# Altium project braking_io.PrjPcb (part 1 of 5)
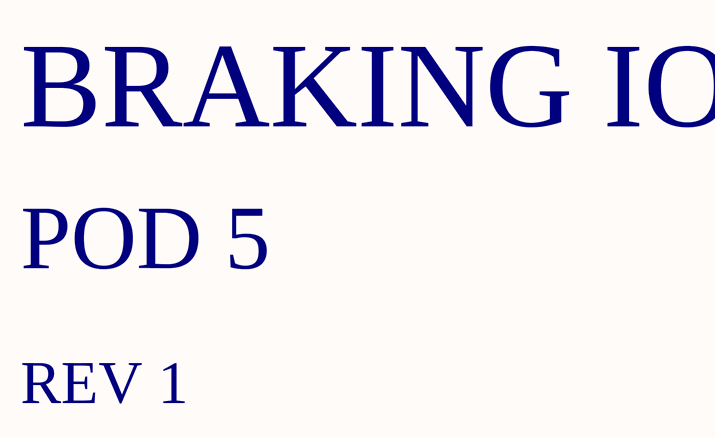
[diagram p0: braking_io.SchDoc]
13 sheets, 451 parts. Net scope: global (net labels, ports and power ports of the same name join across sheets).
Board file: braking_io.PcbDoc
Sheets:
  braking_io.SchDoc
  connectors.SchDoc
  bus_filter.SchDoc
  power_7V.SchDoc
  power_5V.SchDoc
  power_24V.SchDoc
  solenoid.SchDoc
  solenoid_drv.SchDoc
  pressure.SchDoc
  telemetry_adc.SchDoc
  watchdog.SchDoc
  retro.SchDoc
  mcu.SchDoc

## Sheet braking_io.SchDoc: Braking IO PCB
size A4; Organization: Badgerloop Electrical; Address1: 133 Engineering Research Building; Address2: 1500 Engineering Drive; Address3: Madison, Wi 53706

### Notes on the sheet
- BRAKING IO
- POD 5
- REV 1
- Title
- Engineer:
- Date:
- Time:
- Revision:
- Sheet
- of
- File:

## Sheet connectors.SchDoc: Connectors
size A4; Organization: Badgerloop Electrical; Address1: 133 Engineering Research Building; Address2: 1500 Engineering Drive; Address3: Madison, Wi 53706
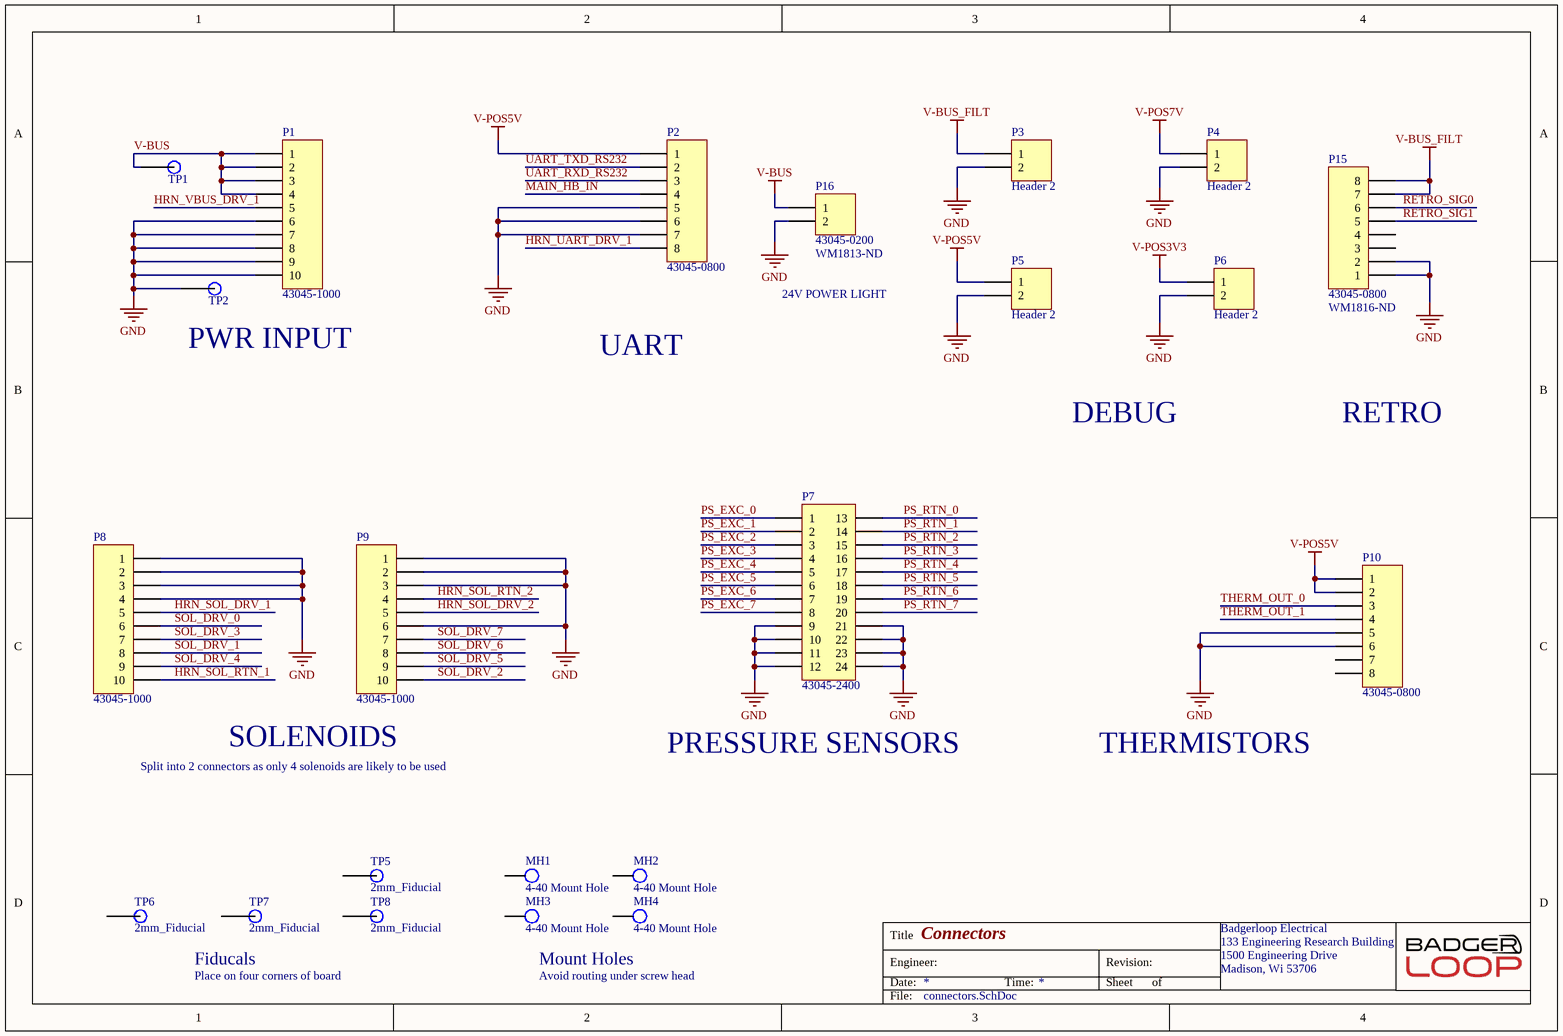
[diagram p1: connectors.SchDoc]

### Parts
MH1  4-40 Mount Hole  [MH]
MH2  4-40 Mount Hole  [MH]
MH3  4-40 Mount Hole  [MH]
MH4  4-40 Mount Hole  [MH]
P1  43045-1000  [430451000]
P2  43045-0800  [430450800]
P3  Header 2  [Pin Header 1x2 TH Pitch 2.54mm]
P4  Header 2  [Pin Header 1x2 TH Pitch 2.54mm]
P5  Header 2  [Pin Header 1x2 TH Pitch 2.54mm]
P6  Header 2  [Pin Header 1x2 TH Pitch 2.54mm]
P7  43045-2400  [430452400]
P8  43045-1000  [430451000]
P9  43045-1000  [430451000]
P10  43045-0800  [430450800]
P15  43045-0800  Supplier Part Number 1: WM1816-ND  [430450800]
P16  43045-0200  Supplier Part Number 1: WM1813-ND  [430450200]
TP1  TP  [Test Point]  (value not drawn)
TP2  TP  [Test Point]  (value not drawn)
TP5  2mm_Fiducial  [2mm_Fiducial]
TP6  2mm_Fiducial  [2mm_Fiducial]
TP7  2mm_Fiducial  [2mm_Fiducial]
TP8  2mm_Fiducial  [2mm_Fiducial]

### Nets
GND: P1.6 P1.7 P1.8 P1.9 P1.10 P2.5 P2.6 P2.7 P3.2 P4.2 P5.2 P6.2 P7.9 P7.10 P7.11 P7.12 P7.21 P7.22 P7.23 P7.24 P8.1 P8.2 P8.3 P8.4 P9.1 P9.2 P9.3 P9.6 P10.5 P10.6 P15.1 P15.2 P16.2 TP2.1
V-BUS: P1.1 P1.2 P1.3 P1.4 P16.1 TP1.1
V-BUS_FILT: P3.1 P15.7 P15.8
V-POS3V3: P6.1
V-POS5V: P2.1 P5.1 P10.1 P10.2
V-POS7V: P4.1
HRN_SOL_DRV_1: P8.5
HRN_SOL_DRV_2: P9.5
HRN_SOL_RTN_1: P8.10
HRN_SOL_RTN_2: P9.4
HRN_UART_DRV_1: P2.8
HRN_VBUS_DRV_1: P1.5
MAIN_HB_IN: P2.4
PS_EXC_0: P7.1
PS_EXC_1: P7.2
PS_EXC_2: P7.3
PS_EXC_3: P7.4
PS_EXC_4: P7.5
PS_EXC_5: P7.6
PS_EXC_6: P7.7
PS_EXC_7: P7.8
PS_RTN_0: P7.13
PS_RTN_1: P7.14
PS_RTN_2: P7.15
PS_RTN_3: P7.16
PS_RTN_4: P7.17
PS_RTN_5: P7.18
PS_RTN_6: P7.19
PS_RTN_7: P7.20
RETRO_SIG0: P15.6
RETRO_SIG1: P15.5
SOL_DRV_0: P8.6
SOL_DRV_1: P8.8
SOL_DRV_2: P9.10
SOL_DRV_3: P8.7
SOL_DRV_4: P8.9
SOL_DRV_5: P9.9
SOL_DRV_6: P9.8
SOL_DRV_7: P9.7
THERM_OUT_0: P10.3
THERM_OUT_1: P10.4
UART_RXD_RS232: P2.3
UART_TXD_RS232: P2.2

Not connected (* = marked no-connect by the designer): MH1 46; MH2 46; MH3 46; MH4 46; P10 7 8; P15 3 4; TP5 1; TP6 1; TP7 1; TP8 1

### Notes on the sheet
- 24V POWER LIGHT
- PWR INPUT
- UART
- DEBUG
- RETRO
- Split into 2 connectors as only 4 solenoids are likely to be used
- (near P9) SOLENOIDS
- PRESSURE SENSORS
- THERMISTORS
- (near TP7) Fiducals
- Place on four corners of board
- Mount Holes
- Avoid routing under screw head
- Title
- Engineer:
- Date:
- Time:
- Revision:
- Sheet
- of
- File:

### Library data of the parts
P1 P8 P9 = 43045-1000: GLOVE, POLYAMIDE, L/FREE, PU, SIZE 6 - More Details; Manufacturer: Molex; Connector Type: Power,Rectangular; Number of Positions: 10; Contact Resistance: 10mR; Gender: Male; Current Rating: 5A; Voltage Rating: 250V; Max Voltage Rating (DC): 250.25kV; Insulation Resistance: 1GR; Pitch: 3mm; Approvals: UL,CSA,TUV; Glow Wire Compliant: Compliant; Supplier 1: Digi-Key; Manufacturer Part Number: 43045-1000; Stock 1: 4799; Pricing 1: 1=2.57000, 10=2.33100, 100=1.99790, 500=1.66496, 1000=1.42710, 5000=1.26536 (USD); RoHS: Yes; Mount: Through Hole,PCB; Contact Plating: Tin; Color: Black; Contact Material: Brass,Tin; Housing Color: Black; Housing Material: Thermoplastic; Material: Polyester; Min Operating Temperature: -40°C; Max Operating Temperature: 105°C; Number of Rows: 2; Termination: Solder; Packaging: Tray; Number of Contacts: 10; Package Quantity: 1224; Orientation: Right Angle; Max Current Rating: 5A; Number of Poles: 10; Voltage Rating (AC): 250V; Number of Circuits: 10; Working Voltage: 250V; Voltage Rating (DC): 250V; Diameter: 3mm; Length: 19.15mm; Height: 8.77mm; Row Spacing: 3mm; Depth: 12.2mm; Radiation Hardening: No; Lead Free: Lead Free; Flammability Rating: UL94 V-0; REACH SVHC: Unknown; Halogen Free: Low Halogen; ComponentLink1URL: https://datasheet.ciiva.com/5150/0430451000-pcb-headers-143006-5150145.pdf?src-supplier=Mouser; ComponentLink1Description: https://datasheet.ciiva.com/5150/0430451000-pcb-headers-143006-5150145.pdf?src-supplier=Mouser; ComponentLink2URL: https://datasheet.ciiva.com/11749/0900766b80027348-11749233.pdf?src-supplier=RSComponents; ComponentLink2Description: https://datasheet.ciiva.com/11749/0900766b80027348-11749233.pdf?src-supplier=RSComponents; ComponentLink3URL: https://datasheet.ciiva.com/19461/883595-19461109.pdf?src-supplier=Jameco; ComponentLink3Description: https://datasheet.ciiva.com/19461/883595-19461109.pdf?src-supplier=Jameco; ComponentLink4URL: https://datasheet.ciiva.com/30068/153980430451000-pcb-headers-30068060.pdf?src-supplier=Onlinecomponents.com; ComponentLink4Description: https://datasheet.ciiva.com/30068/153980430451000-pcb-headers-30068060.pdf?src-supplier=Onlinecomponents.com; ComponentLink5URL: https://datasheet.ciiva.com/14155/04402310-14155207.pdf?src-supplier=Distrelec; ComponentLink5Description: https://datasheet.ciiva.com/14155/04402310-14155207.pdf?src-supplier=Distrelec; ComponentLink6URL: https://datasheet.ciiva.com/18454/70090797-18454139.pdf?src-supplier=Allied+Electronics; ComponentLink6Description: https://datasheet.ciiva.com/18454/70090797-18454139.pdf?src-supplier=Allied+Electronics; ComponentLink7URL: https://datasheet.ciiva.com/16658/0430451000-pcb-headers-16658413.pdf?src-supplier=Avnet+Europe; ComponentLink7Description: https://datasheet.ciiva.com/16658/0430451000-pcb-headers-16658413.pdf?src-supplier=Avnet+Europe; ComponentLink8URL: https://datasheet.ciiva.com/9468/0430451000-pcb-headers-9468495.pdf?src-supplier=Avnet; ComponentLink8Description: https://datasheet.ciiva.com/9468/0430451000-pcb-headers-9468495.pdf?src-supplier=Avnet; Supplier Part Number 1: WM1817-ND
P2 P10 P15 = 43045-0800: CONN HEADER R/A 8POS 3MM; Manufacturer: Molex; Number of Contacts: 8; Contact Resistance: 10mR; Max Voltage Rating (DC): 250.25kV; Current Rating: 5A; Voltage Rating (AC): 250V; Voltage Rating: 600V; Gender: Male; Insulation Resistance: 1GR; Approvals: UL,CSA,TUV; Glow Wire Compliant: Compliant; Supplier 1: Digi-Key; Manufacturer Part Number: 43045-0800; Stock 1: 2632; Pricing 1: 1=1.91000, 10=1.73100, 100=1.48390, 500=1.23656, 1000=1.05990, 5000=0.93978, 10000=0.91858 (USD); RoHS: Yes; Mount: Through Hole; Case/Package: SMC; Contact Plating: Tin; Contact Material: Brass,Tin; Color: Black; Housing Color: Black; Housing Material: Thermoplastic; Material: Polyester; Min Operating Temperature: -40°C; Max Operating Temperature: 105°C; Number of Rows: 2; Termination: Solder; Packaging: Tray; Number of Positions: 8; Orientation: Right Angle; Number of Poles: 8; Package Quantity: 1440; Max Current Rating: 5A; Number of Circuits: 8; Working Voltage: 250V; Voltage Rating (DC): 250V; Diameter: 3mm; Length: 16.15mm; Height: 8.77mm; Pitch: 3mm; Row Spacing: 3mm; Depth: 12.2mm; Radiation Hardening: No; Flammability Rating: UL94 V-0; REACH SVHC: Unknown; Halogen Free: Low Halogen; Lead Free: Lead Free; ComponentLink1URL: https://datasheet.ciiva.com/5158/0430450800-pcb-headers-142625-5158817.pdf?src-supplier=Mouser; ComponentLink1Description: https://datasheet.ciiva.com/5158/0430450800-pcb-headers-142625-5158817.pdf?src-supplier=Mouser; ComponentLink2URL: https://datasheet.ciiva.com/7683/27645-7683683.pdf?src-supplier=Element14; ComponentLink2Description: https://datasheet.ciiva.com/7683/27645-7683683.pdf?src-supplier=Element14; ComponentLink3URL: https://datasheet.ciiva.com/19462/883536-19462164.pdf?src-supplier=Jameco; ComponentLink3Description: https://datasheet.ciiva.com/19462/883536-19462164.pdf?src-supplier=Jameco; ComponentLink4URL: https://datasheet.ciiva.com/11751/0900766b80027348-11751142.pdf?src-supplier=RSComponents; ComponentLink4Description: https://datasheet.ciiva.com/11751/0900766b80027348-11751142.pdf?src-supplier=RSComponents; ComponentLink5URL: https://datasheet.ciiva.com/30198/267770430450800-pcb-headers-30198875.pdf?src-supplier=Onlinecomponents.com; ComponentLink5Description: https://datasheet.ciiva.com/30198/267770430450800-pcb-headers-30198875.pdf?src-supplier=Onlinecomponents.com; ComponentLink6URL: https://datasheet.ciiva.com/1443/1850016-1443537.pdf?src-supplier=Element14; ComponentLink6Description: https://datasheet.ciiva.com/1443/1850016-1443537.pdf?src-supplier=Element14; ComponentLink7URL: https://datasheet.ciiva.com/14155/04402310-14155206.pdf?src-supplier=Distrelec; ComponentLink7Description: https://datasheet.ciiva.com/14155/04402310-14155206.pdf?src-supplier=Distrelec; ComponentLink8URL: https://datasheet.ciiva.com/16657/0430450800-pcb-headers-16657964.pdf?src-supplier=Avnet+Europe; ComponentLink8Description: https://datasheet.ciiva.com/16657/0430450800-pcb-headers-16657964.pdf?src-supplier=Avnet+Europe; ComponentLink9URL: https://datasheet.ciiva.com/10087/0430450800-pcb-headers-10087853.pdf?src-supplier=Avnet; ComponentLink9Description: https://datasheet.ciiva.com/10087/0430450800-pcb-headers-10087853.pdf?src-supplier=Avnet
  P2 P10: Supplier Part Number 1: WM1816-ND
P3-P6 = Header 2: Header, 2-Pin; LatestRevisionDate: 17-Jul-2002; LatestRevisionNote: Re-released for DXP Platform.; Publisher: Altium Limited
P7 = 43045-2400: Molex MICRO-FIT 3.0 Series, Series Number 43045, 3mm Pitch 24 Way 2 Row Right Angle PCB Header, Solder Termination, 5A; Number of Contacts: 24; Contact Resistance: 10mR; Max Voltage Rating (DC): 250.25kV; Voltage Rating: 600V; Voltage Rating (AC): 250V; Gender: Male; Insulation Resistance: 1GR; Approvals: UL,CSA,TUV; Glow Wire Compliant: Compliant; Supplier 1: Digi-Key; Manufacturer: Molex; Manufacturer Part Number: 43045-2400; Stock 1: 970; Pricing 1: 1=6.20000, 10=5.95100, 100=4.95920, 576=4.21531, 1152=3.59542 (USD); RoHS: Yes; Mount: Through Hole; Contact Plating: Tin; Contact Material: Brass,Tin; Color: Black; Housing Color: Black; Housing Material: Thermoplastic; Min Operating Temperature: -40°C; Max Operating Temperature: 105°C; Number of Rows: 2; Termination: Solder; Packaging: Tray; Number of Positions: 24; Orientation: Right Angle; Max Current Rating: 5A; Current Rating: 5A; Package Quantity: 576; Number of Poles: 24; Number of Circuits: 24; Working Voltage: 250V; Operating Supply Voltage: 250V; Voltage Rating (DC): 250V; Length: 40.15mm; Height: 8.77mm; Pitch: 3mm; Row Spacing: 3mm; Depth: 12.2mm; Lead Pitch: 3mm; Radiation Hardening: No; Flammability Rating: UL94 V-0; REACH SVHC: Unknown; Halogen Free: Low Halogen; Lead Free: Lead Free; ComponentLink1URL: https://datasheet.ciiva.com/19461/800104-19461233.pdf?src-supplier=Jameco; ComponentLink1Description: https://datasheet.ciiva.com/19461/800104-19461233.pdf?src-supplier=Jameco; ComponentLink2URL: https://datasheet.ciiva.com/36179/144580430452400-pcb-headers-36179650.pdf?src-supplier=Onlinecomponents.com; ComponentLink2Description: https://datasheet.ciiva.com/36179/144580430452400-pcb-headers-36179650.pdf?src-supplier=Onlinecomponents.com; ComponentLink3URL: https://datasheet.ciiva.com/5156/0430452400-pcb-headers-5156852.pdf?src-supplier=Mouser; ComponentLink3Description: https://datasheet.ciiva.com/5156/0430452400-pcb-headers-5156852.pdf?src-supplier=Mouser; ComponentLink4URL: https://datasheet.ciiva.com/11748/0900766b80d6135b-11748645.pdf?src-supplier=RSComponents; ComponentLink4Description: https://datasheet.ciiva.com/11748/0900766b80d6135b-11748645.pdf?src-supplier=RSComponents; ComponentLink5URL: https://datasheet.ciiva.com/7839/1596512-7839674.pdf?src-supplier=Element14; ComponentLink5Description: https://datasheet.ciiva.com/7839/1596512-7839674.pdf?src-supplier=Element14; ComponentLink6URL: https://datasheet.ciiva.com/16657/0430452400-pcb-headers-16657916.pdf?src-supplier=Avnet+Europe; ComponentLink6Description: https://datasheet.ciiva.com/16657/0430452400-pcb-headers-16657916.pdf?src-supplier=Avnet+Europe; ComponentLink7URL: https://datasheet.ciiva.com/14155/04402310-14155214.pdf?src-supplier=Distrelec; ComponentLink7Description: https://datasheet.ciiva.com/14155/04402310-14155214.pdf?src-supplier=Distrelec; Supplier Part Number 1: WM4728-ND
P16 = 43045-0200: CONN HEADER R/A 2POS; Manufacturer: Molex; Contact Resistance: 10mR; Number of Contacts: 2; Voltage Rating: 600V; Current Rating: 5A; Gender: Male; Max Voltage Rating (DC): 250.25kV; Voltage Rating (DC): 250V; Insulation Resistance: 1GR; Pitch: 3mm; Glow Wire Compliant: Compliant; Approvals: UL,CSA,TUV; Supplier 1: Digi-Key; Manufacturer Part Number: 43045-0200; Stock 1: 6320; Pricing 1: 1=0.97000, 10=0.84900, 100=0.73280, 500=0.59958, 1000=0.53296, 5000=0.46634, 10000=0.44302 (USD); RoHS: Yes; Mount: Through Hole; Case/Package: SMC; Contact Plating: Tin; Color: Black; Contact Material: Brass,Tin; Housing Color: Black; Housing Material: Thermoplastic; Material: Thermoplastic; Min Operating Temperature: -40°C; Max Operating Temperature: 105°C; Termination: Through Hole; Number of Rows: 2; Orientation: Right Angle; Packaging: Tray; Number of Positions: 2; Package Quantity: 3168; Number of Circuits: 2; Contact Gender: Male; Diameter: 3mm; Row Spacing: 3mm; Radiation Hardening: No; Flammability Rating: UL94 V-0; REACH SVHC: Unknown; Lead Free: Lead Free; Halogen Free: Low Halogen; ComponentLink1URL: https://datasheet.ciiva.com/14155/04402310-14155203.pdf?src-supplier=Distrelec; ComponentLink1Description: https://datasheet.ciiva.com/14155/04402310-14155203.pdf?src-supplier=Distrelec; ComponentLink2URL: https://datasheet.ciiva.com/19454/883270-19454006.pdf?src-supplier=Jameco; ComponentLink2Description: https://datasheet.ciiva.com/19454/883270-19454006.pdf?src-supplier=Jameco; ComponentLink3URL: https://datasheet.ciiva.com/5150/0430450200-pcb-headers-145770-5150407.pdf?src-supplier=Mouser; ComponentLink3Description: https://datasheet.ciiva.com/5150/0430450200-pcb-headers-145770-5150407.pdf?src-supplier=Mouser; ComponentLink4URL: https://datasheet.ciiva.com/11747/0900766b80027348-11747001.pdf?src-supplier=RSComponents; ComponentLink4Description: https://datasheet.ciiva.com/11747/0900766b80027348-11747001.pdf?src-supplier=RSComponents; ComponentLink5URL: https://datasheet.ciiva.com/16656/0430450200-pcb-headers-16656330.pdf?src-supplier=Avnet+Europe; ComponentLink5Description: https://datasheet.ciiva.com/16656/0430450200-pcb-headers-16656330.pdf?src-supplier=Avnet+Europe; ComponentLink6URL: https://datasheet.ciiva.com/10090/0430450200-pcb-headers-10090299.pdf?src-supplier=Avnet; ComponentLink6Description: https://datasheet.ciiva.com/10090/0430450200-pcb-headers-10090299.pdf?src-supplier=Avnet; ComponentLink7URL: https://datasheet.ciiva.com/36854/124280430450200-pcb-headers-36854331.pdf?src-supplier=Onlinecomponents.com; ComponentLink7Description: https://datasheet.ciiva.com/36854/124280430450200-pcb-headers-36854331.pdf?src-supplier=Onlinecomponents.com; ComponentLink8URL: https://datasheet.ciiva.com/1443/1859921-1443437.pdf?src-supplier=Element14; ComponentLink8Description: https://datasheet.ciiva.com/1443/1859921-1443437.pdf?src-supplier=Element14
TP1 TP2 = TP: SMD TEST POINT

## Sheet bus_filter.SchDoc: Bus Filter
size A4; Organization: Badgerloop Electrical; Address1: 133 Engineering Research Building; Address2: 1500 Engineering Drive; Address3: Madison, Wi 53706
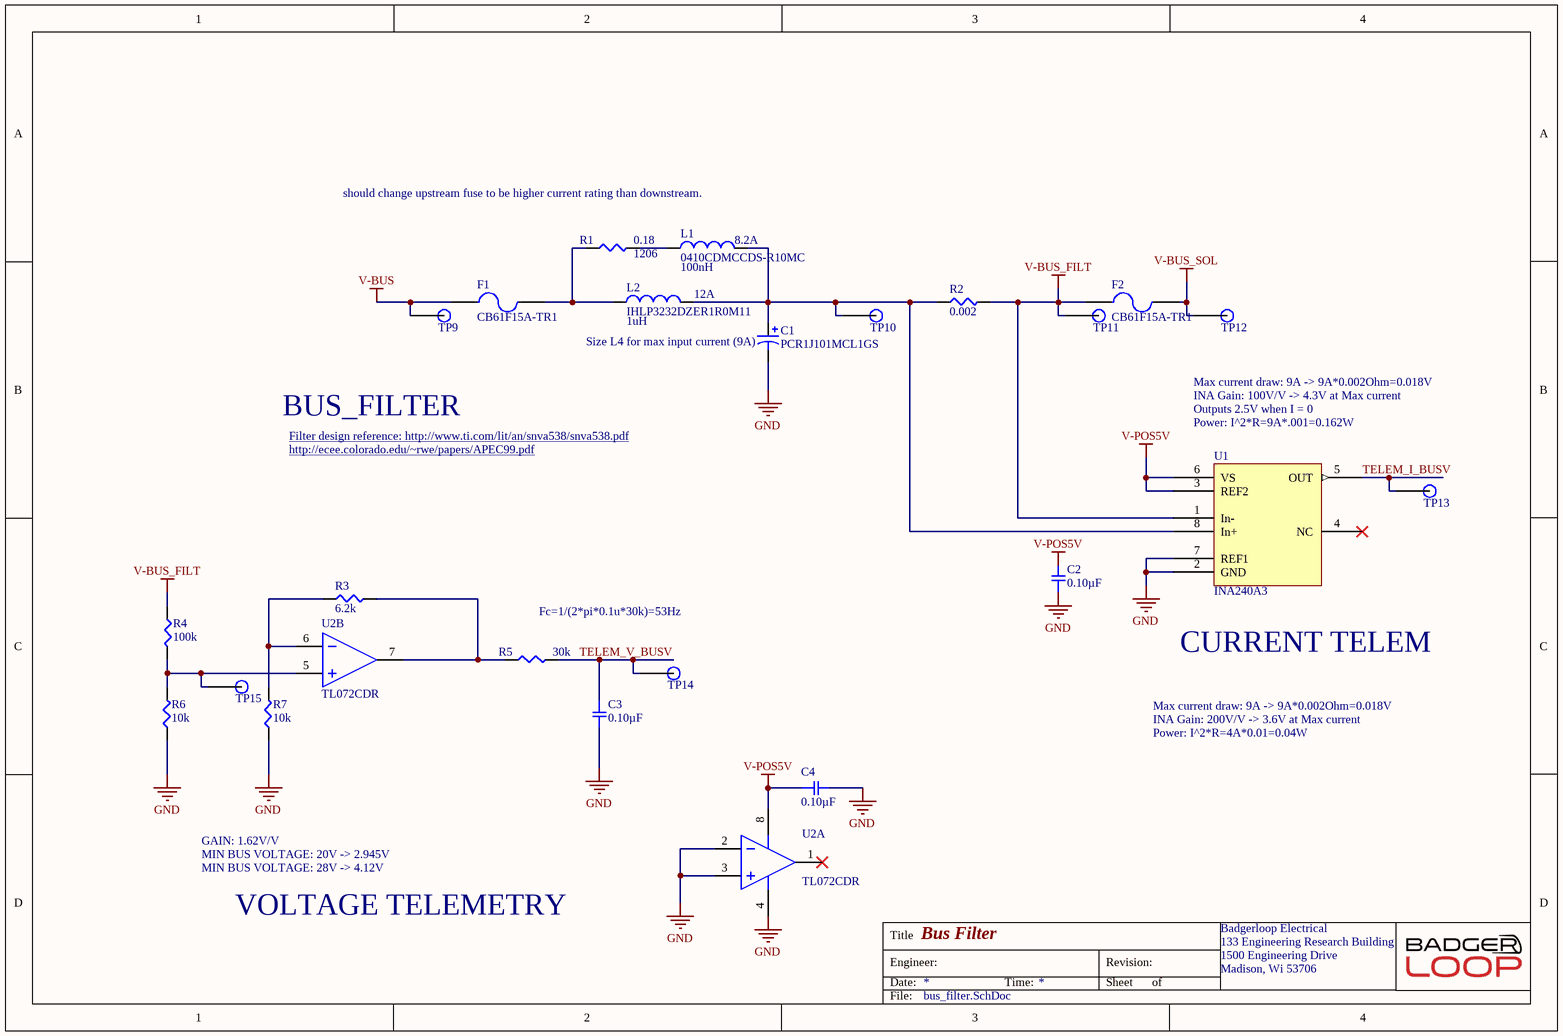
[diagram p2: bus_filter.SchDoc]

### Parts
C1  PCR1J101MCL1GS  [CAPAE110103X126M]
C2  0.10µF  [SMD-0805C]
C3  0.10µF  [SMD-0805C]
C4  0.10µF  [SMD-0805C]
F1  CB61F15A-TR1  [RESC6132X26N]
F2  CB61F15A-TR1  [RESC6132X26N]
L1  0410CDMCCDS-R10MC  Inductance: 100nH  Saturation Current: 8.2A  [INDM4442X20N]
L2  IHLP3232DZER1R0M11  Saturation Current: 12A  Inductance: 1uH  [INDM8682X40N]
R1  0.18  Supplier Device Package: 1206  [SMD-1206-RES]
R2  0.002  [SMD-1206-RES]
R3  6.2k  [SMD-0805-RES]
R4  100k  [SMD-0805-RES]
R5  30k  [SMD-0805-RES]
R6  10k  [SMD-0805-RES]
R7  10k  [SMD-0805-RES]
TP9  TP  [Test Point]  (value not drawn)
TP10  TP  [Test Point]  (value not drawn)
TP11  TP  [Test Point]  (value not drawn)
TP12  TP  [Test Point]  (value not drawn)
TP13  TP  [Test Point]  (value not drawn)
TP14  TP  [Test Point]  (value not drawn)
TP15  TP  [Test Point]  (value not drawn)
U1  INA240A3  [SOIC127P600X175-8N]
U2  TL072CDR  [SOP127P600X175-8N]  (parts A,B of 2)

### Nets
GND: C1.2 C2.1 C3.2 C4.2 R6.1 R7.1 U1.2(GND) U1.7(REF1) U2.2(IN-) U2.3(IN+) U2.4(V-)
V-BUS: F1.1 TP9.1
V-BUS_FILT: F2.1 R2.2 R4.1 TP11.1 U1.1(In-)
V-BUS_SOL: F2.2 TP12.1
V-POS5V: C2.2 C4.1 U1.3(REF2) U1.6(VS) U2.8(V+)
TELEM_I_BUSV: TP13.1 U1.5(OUT)
TELEM_V_BUSV: C3.1 R5.2 TP14.1
NetC1_1: C1.1 L1.2 L2.2 R2.1 TP10.1 U1.8(In+)
NetF1_2: F1.2 L2.1 R1.1
NetL1_1: L1.1 R1.2
NetR3_1: R3.1 R7.2 U2.6(IN-)
NetR3_2: R3.2 R5.1 U2.7(OUT)
NetR4_2: R4.2 R6.2 TP15.1 U2.5(IN+)

Not connected (* = marked no-connect by the designer): U1 4(NC)*; U2 1(OUT)*

### Notes on the sheet
- should change upstream fuse to be higher current rating than downstream.
- (near C1) Size L4 for max input current (9A)
- Max current draw: 9A -> 9A*0.002Ohm=0.018V
- BUS_FILTER
- Filter design reference: http://www.ti.com/lit/an/snva538/snva538.pdf <http://www.ti.com/lit/an/snva538/snva538.pdf>
- INA Gain: 100V/V -> 4.3V at Max current
- (near U1) Power: I^2*R=9A*.001=0.162W
- Outputs 2.5V when I = 0
- http://ecee.colorado.edu/~rwe/papers/APEC99.pdf
- Fc=1/(2*pi*0.1u*30k)=53Hz
- CURRENT TELEM
- INA Gain: 200V/V -> 3.6V at Max current
- Power: I^2*R=4A*0.01=0.04W
- GAIN: 1.62V/V
- MIN BUS VOLTAGE: 20V -> 2.945V
- MIN BUS VOLTAGE: 28V -> 4.12V
- VOLTAGE TELEMETRY
- Title
- Engineer:
- Date:
- Time:
- Revision:
- Sheet
- of
- File:

### Library data of the parts
C1 = PCR1J101MCL1GS: CAP ALUM POLY 100UF 20% 63V SMD; Manufacturer: Nichicon; ESR (Equivalent Series Resistance): 24mR; Ripple Current: 3A; Leakage Current: 3uA; Life (Hours): 4000Hour; Dissipation Factor: 0.08%; Supplier 1: Digi-Key; Manufacturer Part Number: PCR1J101MCL1GS; Stock 1: 11476; Pricing 1: 1=3.63000, 10=2.92800, 100=2.28380 (USD); RoHS: Yes; Mount: Surface Mount,PCB; Case/Package: Radial; Weight: 0.045856oz; Min Operating Temperature: -55°C; Max Operating Temperature: 125°C; Capacitance: 100uF; Tolerance: 20%; Voltage Rating (DC): 63V; Package Quantity: 1; Packaging: Tape and Reel; Voltage Rating: 63V; Termination: SMD/SMT; Voltage: 63V; Diameter: 10mm; Length: 12.7mm; Height: 12.7mm; Height - Seated (Max): 0.504inch; Depth: 10.3mm; Lead Pitch: 4.6mm; Lead Free: Lead Free; ComponentLink1URL: https://datasheet.ciiva.com/29551/e-ch-ta-29551389.pdf?src-supplier=Digi-Key; ComponentLink1Description: https://datasheet.ciiva.com/29551/e-ch-ta-29551389.pdf?src-supplier=Digi-Key; ComponentLink2URL: https://datasheet.ciiva.com/29551/e-ch-ta-29551390.pdf?src-supplier=Digi-Key; ComponentLink2Description: https://datasheet.ciiva.com/29551/e-ch-ta-29551390.pdf?src-supplier=Digi-Key; ComponentLink3URL: https://datasheet.ciiva.com/29551/e-ch-ta-29551391.pdf?src-supplier=Digi-Key; ComponentLink3Description: https://datasheet.ciiva.com/29551/e-ch-ta-29551391.pdf?src-supplier=Digi-Key; Supplier Part Number 1: 493-13783-1-ND
C2 C4 = GRM21B7U1A104JA01L: CAP CER 0.1UF 10V U2J 0805; Manufacturer: Murata Electronics North America; Factory Stock: 0; Unit Price (USD): 0.4; Minimum Quantity: 1; Tolerance: ±5%; Datasheets: http://www.murata.com/~/media/webrenewal/support/library/catalog/products/capacitor/mlcc/c02e.pdf; Image: //media.digikey.com/Renders/Murata%20Renders/0805%20(2012%20Metric)%20.85mm.jpg; Digi-Key Part Number: 490-11592-1-ND; Part Number: GRM21B7U1A104JA01L; Quantity Available: 3390; @ qty: 0; Packaging: Cut Tape (CT); Series: GRM; Part Status: Active; Value: 0.10µF; Voltage: 10V; Temperature Coefficient: U2J; Operating Temperature: -55°C ~ 125°C; Features: -; Ratings: -; Applications: General Purpose; Mounting Type: Surface Mount, MLCC; Package / Case: 0805 (2012 Metric); Size / Dimension: 0.079" L x 0.049" W (2.00mm x 1.25mm); Height - Seated (Max): -; Thickness (Max): 0.053" (1.35mm); Lead Spacing: -; Lead Style: -
C3 = GRM219R71C104KA01D: CAP CER 0.1UF 16V X7R 0805; Manufacturer: Murata Electronics North America; Factory Stock: 0; Unit Price (USD): 0.13; Minimum Quantity: 1; Tolerance: ±10%; Datasheets: http://www.murata.com/~/media/webrenewal/support/library/catalog/products/capacitor/mlcc/c02e.pdf; Image: //media.digikey.com/Renders/Murata%20Renders/0805%20(2012%20Metric)%20.85mm.jpg; Digi-Key Part Number: 490-1683-1-ND; Part Number: GRM219R71C104KA01D; Quantity Available: 265464; @ qty: 0; Packaging: Cut Tape (CT); Series: GRM; Part Status: Active; Value: 0.10µF; Voltage: 16V; Temperature Coefficient: X7R; Operating Temperature: -55°C ~ 125°C; Features: -; Ratings: -; Applications: General Purpose; Mounting Type: Surface Mount, MLCC; Package / Case: 0805 (2012 Metric); Size / Dimension: 0.079" L x 0.049" W (2.00mm x 1.25mm); Height - Seated (Max): -; Thickness (Max): 0.037" (0.95mm); Lead Spacing: -; Lead Style: -
F1 F2 = CB61F15A-TR1: Manufacturer: Eaton; Current Rating: 15A; Voltage Rating (AC): 125V; DC Cold Resistance: 4mR; Fuse Type: Board Mount (Cartridge Style Excluded); Approvals: cULus,PSE; Supplier 1: Digi-Key; Manufacturer Part Number: CB61F15A-TR1; Stock 1: 11809; Pricing 1: 1=1.15000, 5=1.11800, 10=1.04600, 50=0.86600, 100=0.72160, 250=0.70356, 500=0.59532 (USD); RoHS: Yes; Mount: Surface Mount; Case/Package: SMD/SMT; Packaging: Tape and Reel; Voltage Rating (DC): 125V; Voltage Rating: 125V; Length: 0.24inch; Height: 0.101inch; Width: 0.101inch; Depth: 2.57mm; Lead Free: Lead Free; ComponentLink1URL: http://components.arrow.com/part/dataview/0323_05918082?src-supplier=Arrow+Europe; ComponentLink1Description: http://components.arrow.com/part/dataview/0323_05918082?src-supplier=Arrow+Europe; ComponentLink2URL: http://www.cooperindustries.com/content/dam/public/bussmann/Electronics/Resources/product-datasheets/bus-elx-ds-4377-cb61f.pdf?src-supplier=Avnet+Asia; ComponentLink2Description: http://www.cooperindustries.com/content/dam/public/bussmann/Electronics/Resources/product-datasheets/bus-elx-ds-4377-cb61f.pdf?src-supplier=Avnet+Asia; ComponentLink3URL: http://www.cooperindustries.com/content/dam/public/bussmann/Electronics/Resources/product-datasheets/bus-elx-ds-4377-cb61f.pdf?src-supplier=Avnet; ComponentLink3Description: http://www.cooperindustries.com/content/dam/public/bussmann/Electronics/Resources/product-datasheets/bus-elx-ds-4377-cb61f.pdf?src-supplier=Avnet; ComponentLink4URL: http://www.cooperindustries.com/content/dam/public/bussmann/Electronics/Resources/product-datasheets/bus-elx-ds-4377-cb61f.pdf?src-supplier=Digi-Key; ComponentLink4Description: http://www.cooperindustries.com/content/dam/public/bussmann/Electronics/Resources/product-datasheets/bus-elx-ds-4377-cb61f.pdf?src-supplier=Digi-Key; Supplier Part Number 1: 283-4104-1-ND
L1 = 0410CDMCCDS-R10MC: Manufacturer: Sumida; Supplier 1: Digi-Key; Manufacturer Part Number: 0410CDMCCDS-R10MC; Stock 1: 5994; Pricing 1: 1=0.93000, 10=0.81700, 100=0.58360, 500=0.49024, 1000=0.39687 (USD); RoHS: No; Supplier Part Number 1: 308-2523-1-ND
L2 = IHLP3232DZER1R0M11: Fixed Inductors 1uH 20% Low Profile; Manufacturer: Vishay Dale; Core Material: Metal,Composite,Ferrite; Current Rating: 18.2A; Shielding: Shielded; Self Resonant Frequency: 49MHz; DC Resistance (DCR): 4.63mR; Test Frequency: 100kHz; Supplier 1: Digi-Key; Manufacturer Part Number: IHLP3232DZER1R0M11; Stock 1: 9463; Pricing 1: 1=1.61000, 10=1.49500, 100=1.08100 (USD); RoHS: Yes; Mount: Surface Mount; Case/Package: 3232; Number of Pins: 2; Min Operating Temperature: -55°C; Max Operating Temperature: 125°C; Inductance Tolerance: 20%; Packaging: Tape and Reel; Tolerance: 20%; Package Quantity: 500; Max DC Current: 18.2A; Termination: SMD/SMT; RMS Current (Irms): 18.2A; Military Standard: Not; Length: 8.64mm; Height: 4mm; Width: 0.322inch; Height - Seated (Max): 0.157inch; Depth: 8.94mm; Radiation Hardening: No; REACH SVHC: Unknown; Lead Free: Lead Free; ComponentLink1URL: https://datasheet.ciiva.com/6692/ihlp-3232dz-11-6692199.pdf?src-supplier=Digi-Key; ComponentLink1Description: https://datasheet.ciiva.com/6692/ihlp-3232dz-11-6692199.pdf?src-supplier=Digi-Key; ComponentLink2URL: https://datasheet.ciiva.com/6692/ihlp-3232dz-11-6692200.pdf?src-supplier=Digi-Key; ComponentLink2Description: https://datasheet.ciiva.com/6692/ihlp-3232dz-11-6692200.pdf?src-supplier=Digi-Key; ComponentLink3URL: https://datasheet.ciiva.com/6692/ihlp-3232dz-11-6692201.pdf?src-supplier=Digi-Key; ComponentLink3Description: https://datasheet.ciiva.com/6692/ihlp-3232dz-11-6692201.pdf?src-supplier=Digi-Key; ComponentLink4URL: https://datasheet.ciiva.com/17113/70231623-17113262.pdf?src-supplier=Allied+Electronics; ComponentLink4Description: https://datasheet.ciiva.com/17113/70231623-17113262.pdf?src-supplier=Allied+Electronics; Supplier Part Number 1: 541-1348-1-ND
R1 = ERJ-8BSFR18V: RES SMD 0.18 OHM 1% 1/2W 1206; Manufacturer: Panasonic Electronic Components; Factory Stock: 0; Unit Price (USD): 0.11739; @ qty: 1500; Minimum Quantity: 1; Power (Watts): 0.5W, 1/2W; Temperature Coefficient: ±250ppm/°C; Part Number: ERJ-8BSFR18V; Datasheets: https://industrial.panasonic.com/cdbs/www-data/pdf/RDA0000/AOA0000C239.pdf; Image: //media.digikey.com/Renders/Panasonic%20Renders/ERJ-1206%20Pkg.jpg; Digi-Key Part Number: P17683CT-ND; Quantity Available: 1772; Packaging: Cut Tape (CT); Series: ERJ; Part Status: Active; Value: 0.18; Tolerance: ±1%; Composition: Thick Film; Features: Automotive AEC-Q200, Current Sense; Operating Temperature: -55°C ~ 125°C; Package / Case: 1206 (3216 Metric); Size / Dimension: 0.126" L x 0.063" W (3.20mm x 1.60mm); Height - Seated (Max): 0.028" (0.70mm); Number of Terminations: 2; Failure Rate: -
R2 = CSNL1206FT2L00TR: RES SMD 0.002 OHM 1% 1W 1206; Manufacturer: Stackpole Electronics; Resistance: 2mR; Temperature Coefficient: 50ppm/°C; ComponentLink1URL: https://www.seielect.com/Catalog/SEI-CSNL.pdf?src-supplier=Avnet; ComponentLink1Description: https://www.seielect.com/Catalog/SEI-CSNL.pdf?src-supplier=Avnet; ComponentLink2URL: https://www.seielect.com/catalog/SEI-Packaging.pdf?src-supplier=Digi-Key; ComponentLink2Description: https://www.seielect.com/catalog/SEI-Packaging.pdf?src-supplier=Digi-Key; Supplier 1: Digi-Key; Manufacturer Part Number: CSNL1206FT2L00; Stock 1: 23112; Pricing 1: 1=0.68, 10=0.566, 25=0.4852, 50=0.4366, 100=0.38, 250=0.33956, 500=0.2749, 1000=0.22234 (USD); Mount: Surface Mount; Case/Package: 1206; Case Code (Metric): 3216; Case Code (Imperial): 1206; Contact Plating: Tin,Matte; Min Operating Temperature: -55°C; Max Operating Temperature: 170°C; Packaging: Tape and Reel; Tolerance: 1%; Power Rating: 1W; Composition: Metal Foil; Number of Terminations: 2; Max Power Dissipation: 1W; Features: Moisture Resistant; Length: 0.126inch; Height: 0.035inch; Width: 0.063inch; Radiation Hardening: No; Lead Free: Lead Free; Supplier Part Number 1: CSNL1206FT2L00DKR-ND
R3 = ERJ-P06J622V: RES SMD 6.2K OHM 5% 1/2W 0805; Manufacturer: Panasonic Electronic Components; Factory Stock: 0; Unit Price (USD): 0.01839; @ qty: 1500; Minimum Quantity: 1; Power (Watts): 0.5W, 1/2W; Temperature Coefficient: ±200ppm/°C; Part Number: ERJ-P06J622V; Datasheets: https://industrial.panasonic.com/cdbs/www-data/pdf/RDA0000/AOA0000C243.pdf; Image: //media.digikey.com/Renders/Panasonic%20Renders/ERJ-0805%20Pkg.jpg; Digi-Key Part Number: P6.2KADCT-ND; Quantity Available: 14652; Packaging: Cut Tape (CT); Series: ERJ; Part Status: Active; Value: 6.2k; Tolerance: ±5%; Composition: Thick Film; Features: Automotive AEC-Q200, Pulse Withstanding; Operating Temperature: -55°C ~ 155°C; Package / Case: 0805 (2012 Metric); Supplier Device Package: 0805; Size / Dimension: 0.079" L x 0.049" W (2.00mm x 1.25mm); Height - Seated (Max): 0.028" (0.70mm); Number of Terminations: 2; Failure Rate: -
R4 = ERJ-P06J104V: RES SMD 100K OHM 5% 1/2W 0805; Manufacturer: Panasonic Electronic Components; Factory Stock: 0; Unit Price (USD): 0.01839; @ qty: 1500; Minimum Quantity: 1; Power (Watts): 0.5W, 1/2W; Temperature Coefficient: ±200ppm/°C; Part Number: ERJ-P06J104V; Datasheets: https://industrial.panasonic.com/cdbs/www-data/pdf/RDA0000/AOA0000C243.pdf; Image: //media.digikey.com/Renders/Panasonic%20Renders/ERJ-0805%20Pkg.jpg; Digi-Key Part Number: P100KADCT-ND; Quantity Available: 82264; Packaging: Cut Tape (CT); Series: ERJ; Part Status: Active; Value: 100k; Tolerance: ±5%; Composition: Thick Film; Features: Automotive AEC-Q200, Pulse Withstanding; Operating Temperature: -55°C ~ 155°C; Package / Case: 0805 (2012 Metric); Supplier Device Package: 0805; Size / Dimension: 0.079" L x 0.049" W (2.00mm x 1.25mm); Height - Seated (Max): 0.028" (0.70mm); Number of Terminations: 2; Failure Rate: -
R5 = ERJ-6ENF3002V: RES SMD 30K OHM 1% 1/8W 0805; Manufacturer: Panasonic Electronic Components; Factory Stock: 0; Unit Price (USD): 0.00729; @ qty: 1500; Minimum Quantity: 1; Power (Watts): 0.125W, 1/8W; Temperature Coefficient: ±100ppm/°C; Part Number: ERJ-6ENF3002V; Datasheets: http://industrial.panasonic.com/www-cgi/jvcr13pz.cgi?E+PZ+3+AOA0002+ERJ6ENF3002V+7+WW; Image: //media.digikey.com/Renders/Panasonic%20Renders/ERJ-0805%20Pkg.jpg; Digi-Key Part Number: P30.0KCCT-ND; Quantity Available: 88046; Packaging: Cut Tape (CT); Series: ERJ; Part Status: Active; Value: 30k; Tolerance: ±1%; Composition: Thick Film; Features: Automotive AEC-Q200; Operating Temperature: -55°C ~ 155°C; Package / Case: 0805 (2012 Metric); Supplier Device Package: 0805; Size / Dimension: 0.079" L x 0.049" W (2.00mm x 1.25mm); Height - Seated (Max): 0.028" (0.70mm); Number of Terminations: 2; Failure Rate: -
R6 R7 = ERJ-P06J103V: RES SMD 10K OHM 5% 1/2W 0805; Manufacturer: Panasonic Electronic Components; Factory Stock: 0; Unit Price (USD): 0.01839; @ qty: 1500; Minimum Quantity: 1; Power (Watts): 0.5W, 1/2W; Temperature Coefficient: ±200ppm/°C; Part Number: ERJ-P06J103V; Datasheets: https://industrial.panasonic.com/cdbs/www-data/pdf/RDA0000/AOA0000C243.pdf; Image: //media.digikey.com/Renders/Panasonic%20Renders/ERJ-0805%20Pkg.jpg; Digi-Key Part Number: P10KADCT-ND; Quantity Available: 413576; Packaging: Cut Tape (CT); Series: ERJ; Part Status: Active; Value: 10k; Tolerance: ±5%; Composition: Thick Film; Features: Automotive AEC-Q200, Pulse Withstanding; Operating Temperature: -55°C ~ 155°C; Package / Case: 0805 (2012 Metric); Supplier Device Package: 0805; Size / Dimension: 0.079" L x 0.049" W (2.00mm x 1.25mm); Height - Seated (Max): 0.028" (0.70mm); Number of Terminations: 2; Failure Rate: -
TP9-TP15 = TP: SMD TEST POINT
U1 = INA240A3: IC AMP CURRENT SENSE 8-TSSOP 100V/V; Manufacturer: Texas Instruments; Number of Circuits: 1; Slew Rate: 2V/µs; -3db Bandwidth: 400kHz; Input Bias Current: 90uA; Input Offset Voltage (Vos): 5uV; Operating Supply Current: 1.8mA; Supplier 1: Digi-Key; Stock 1: 4680; Pricing 1: 1=2.65, 10=2.377, 25=2.2428, 100=1.7943, 250=1.56996, 500=1.52512, 1000=1.21113 (USD); Mount: Surface Mount; Case/Package: TSSOP; Number of Pins: 8; Min Operating Temperature: -40°C; Max Operating Temperature: 125°C; Packaging: Tape and Reel; ComponentLink1URL: http://www.ti.com/general/docs/lit/getliterature.tsp?genericPartNumber=INA240&fileType=pdf&src-supplier=Farnell; ComponentLink1Description: http://www.ti.com/general/docs/lit/getliterature.tsp?genericPartNumber=INA240&fileType=pdf&src-supplier=Farnell; ComponentLink2URL: http://www.ti.com/lit/ds/symlink/ina240.pdf?src-supplier=Digi-Key; ComponentLink2Description: http://www.ti.com/lit/ds/symlink/ina240.pdf?src-supplier=Digi-Key; Supplier Part Number 1: 296-45090-1-ND
U2 = TL072CDR: IC OPAMP JFET 3MHZ 8SOIC; Manufacturer: Texas Instruments; Voltage Gain: 106.02dB; Min Dual Supply Voltage: 3.5V; Max Dual Supply Voltage: 18V; Nominal Supply Current: 5mA; Common Mode Rejection Ratio: 70dB; Number of Channels: 2; Slew Rate: 13V/µs; Max I/O Voltage: 10mV; Input Bias Current: 200pA; Operating Supply Current: 1.4mA; Dual Supply Voltage: 9V; Supplier 1: Digi-Key; Stock 1: 21821; Pricing 1: 1=0.41, 10=0.334, 100=0.2059, 500=0.1562, 1000=0.11715 (USD); Case/Package: D; Number of Pins: 8; Contact Plating: Gold; Min Operating Temperature: -40°C; Max Operating Temperature: 85°C; Package Quantity: 1; Packaging: Tape and Reel; Unity Gain Bandwidth Product: 3MHz; Bandwidth: 3MHz; Nominal Gain Bandwidth Product: 3MHz; Number of Circuits: 2; Gain Bandwidth Product: 3MHz; Input Offset Voltage (Vos): 10mV; Number of Elements: 2; Max Supply Voltage: 18V; Number of Amplifiers: 2; Length: 4.9mm; Height: 1.58mm; Width: 3.91mm; Radiation Hardening: No; Lead Free: Lead Free; REACH SVHC: No SVHC; ComponentLink1URL: http://www.ti.com/lit/ds/symlink/tl071a.pdf?src-supplier=Digi-Key; ComponentLink1Description: http://www.ti.com/lit/ds/symlink/tl071a.pdf?src-supplier=Digi-Key; ComponentLink2URL: http://www.ti.com/general/docs/lit/getliterature.tsp?genericPartNumber=TL072&&fileType=pdf&src-supplier=Avnet; ComponentLink2Description: http://www.ti.com/general/docs/lit/getliterature.tsp?genericPartNumber=TL072&&fileType=pdf&src-supplier=Avnet; ComponentLink3URL: http://www.farnell.com/datasheets/1882732.pdf?src-supplier=Element14; ComponentLink3Description: http://www.farnell.com/datasheets/1882732.pdf?src-supplier=Element14; Supplier Part Number 1: 296-1282-6-ND